# EAGLE design fonte (EAGLE 9.0.1)
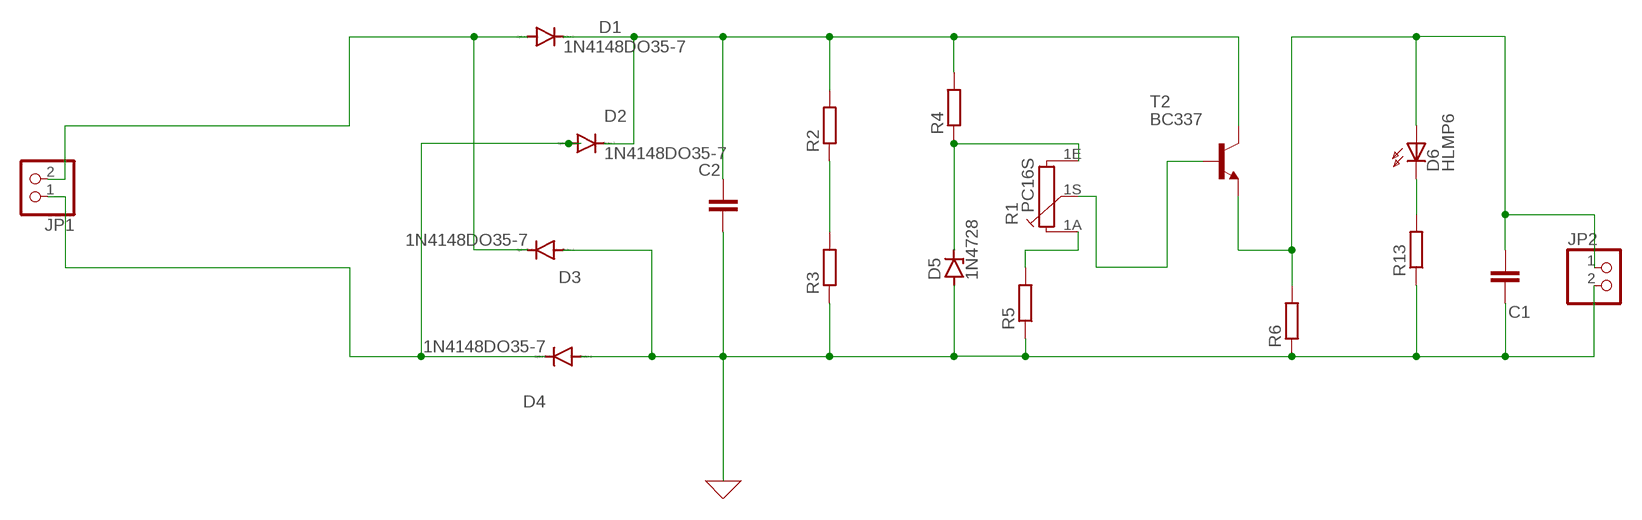
[diagram p0: schematic, sheet 1]

## Parts
C1  C5/3  [C5B3]
C2  C5/3  [C5B3]
D1  1N4148DO35-7  [DO35-7]
D2  1N4148DO35-7  [DO35-7]
D3  1N4148DO35-7  [DO35-7]
D4  1N4148DO35-7  [DO35-7]
D5  1N4728  [DO41Z10]
D6  HLMP6  [HLMP6]
JP1  PINHD-1X2  [1X02]
JP2  PINHD-1X2  [1X02]
R1  PC16S  [PC16S]
R2  R-EU_0204/7  [0204/7]
R3  R-EU_0204/7  [0204/7]
R4  R-EU_0204/7  [0204/7]
R5  R-EU_0204/7  [0204/7]
R6  R-EU_0204/7  [0204/7]
R13  R-EU_0204/7  [0204/7]
T2  BC337  [TO92]

## Nets
0: C1.1 C2.2 D3.A D4.A D5.A JP2.2 R3.1 R5.1 R6.1 R13.1 ; supply symbol labelled GND
1: C1.2 D6.A JP2.1 R6.2 T2.1(E)
N$1: R2.1 R3.2
N$2: D1.A D3.C JP1.2
N$3: R1.1A R5.2
N$4: D2.A D4.C JP1.1
N$5: D5.C R1.1E R4.1
N$6: R1.1S T2.2(B)
N$7: D6.K R13.2
N$13: C2.1 D1.C D2.C R2.2 R4.2 T2.3(C)

## Library data of the parts
C1 C2 = capacitor-wima:C: CAPACITOR naming: grid - package width
D1-D4 = diode:1N4148: DIODE high speed (Philips); SPICEMODEL: DMOD; SPICEPREFIX: D
D5 = diode:1N4728: Z DIODE 3.3 V, 1W, 5 percent; SPICEMODEL: DMOD; SPICEPREFIX: D
D6 = display-hp:HLMP6: LED 2mm horizontal; MF: AGILENT TECHNOLOGIES; MPN: HLMP-6500; OC_FARNELL: 1652490; OC_NEWARK: 40K0088
JP1 JP2 = pinhead:PINHD-1X2: PIN HEADER
R1 = piher:PC16S: POTENTIOMETER single carbon potentiometer, 16 mm, S3ROH; OC_FARNELL: 4452940; OC_NEWARK: unknown
R2-R6 R13 = rcl:R-EU_: RESISTOR, European symbol; SPICEPREFIX: R
T2 = transistor:BC337: NPN TRANSISTOR

## Board
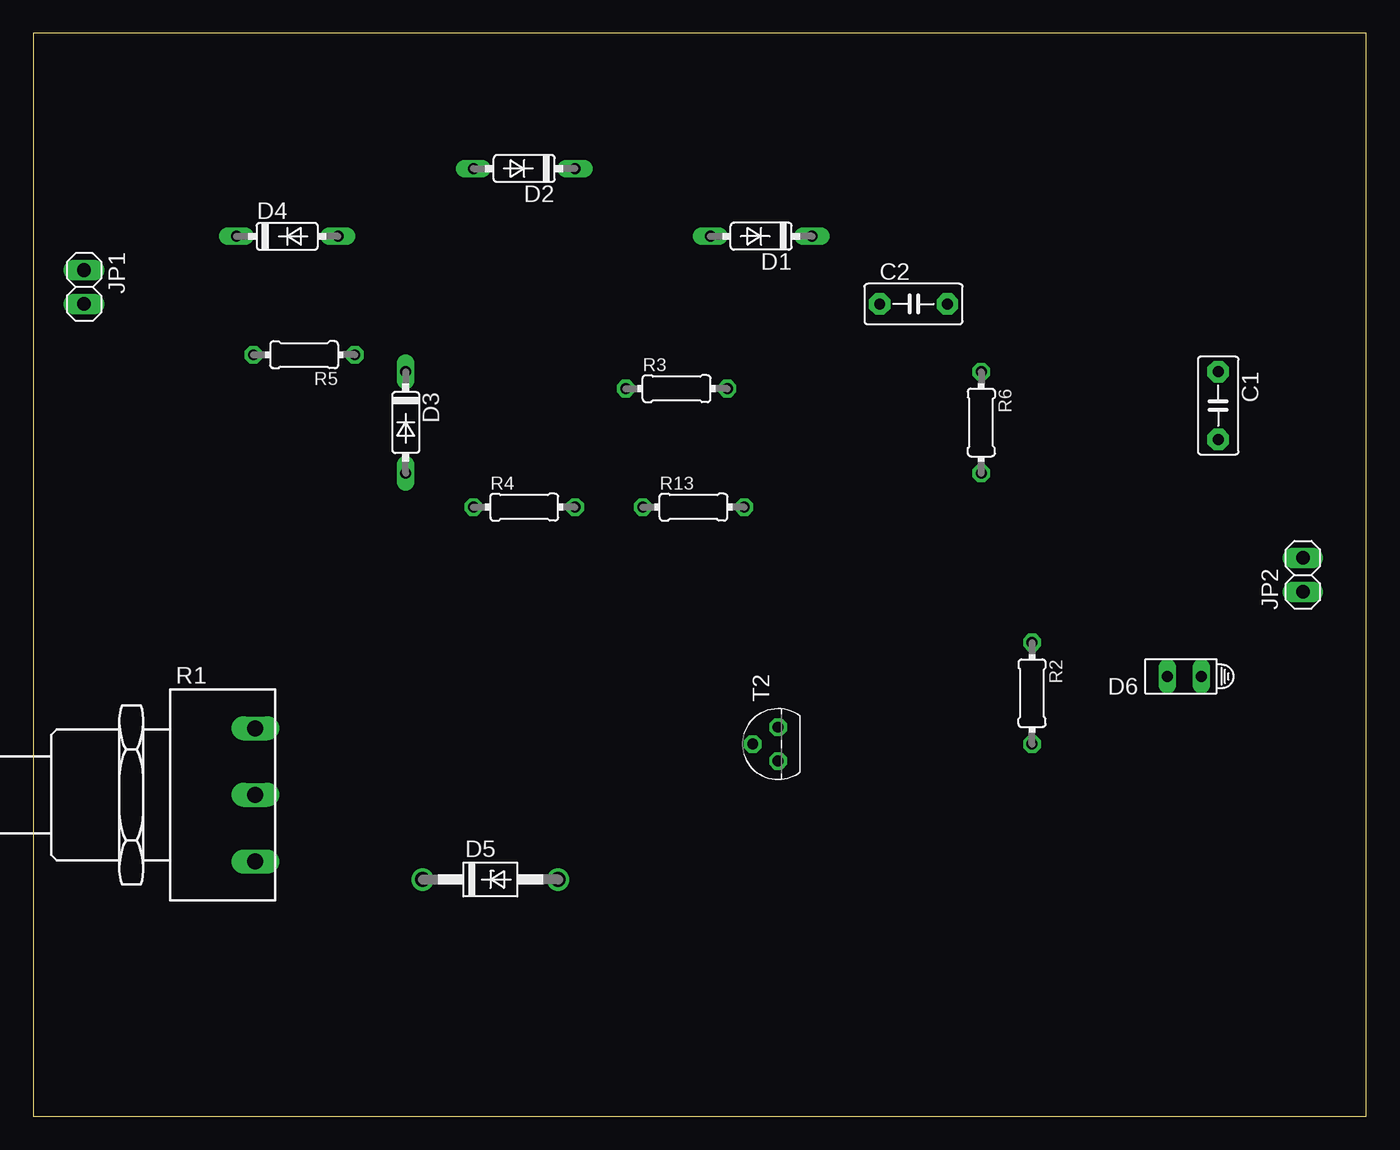
[diagram p1: board, top side]
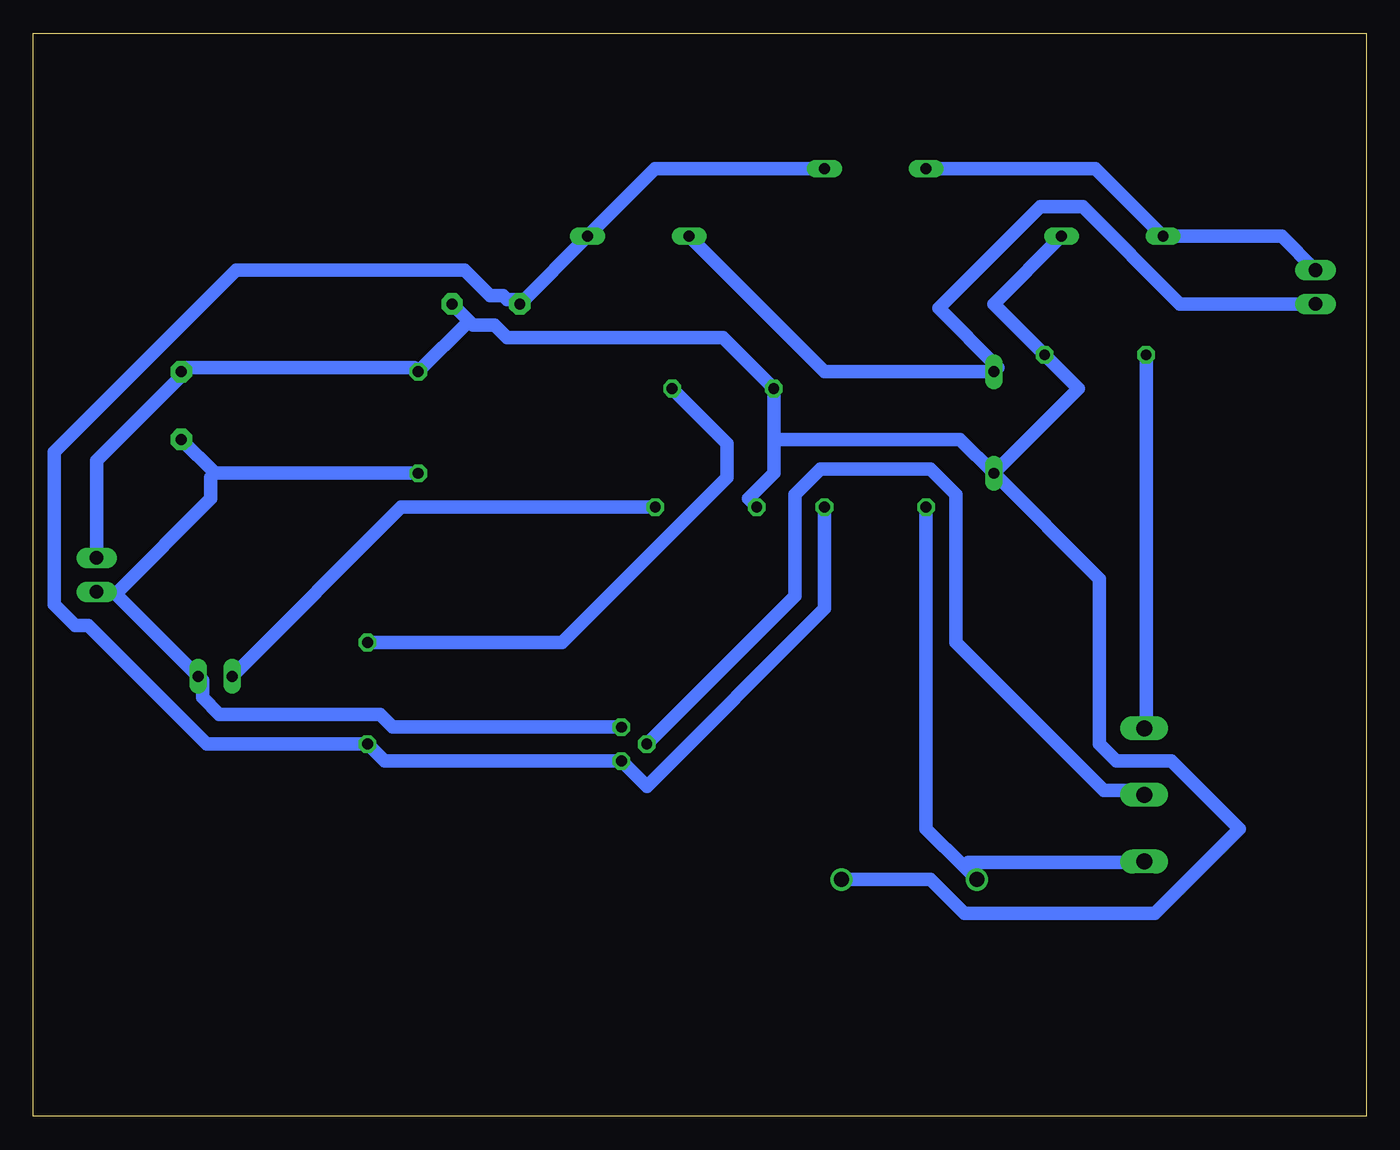
[diagram p2: board, bottom side, seen from below]

Size 100 x 81.27 mm. Coordinates in mm from the lower left corner, seen from the top.
Outline: 0,0 100,0 100,81.27 0,81.27 0,0
Copper layers (1*16): Top 0.035mm / dielectric 1.5mm / Bottom 0.035mm
Design rules "default *": minimum track width 40mil, minimum drill 0.35mm, track to track 40mil, track to pad 40mil, pad to pad 40mil, via to via 40mil, smd to smd 40mil, copper to edge 40mil, drill to drill 40mil, minimum pad ring 10mil, minimum via ring 8mil, stop-mask expansion 4mil, vias tented up to drill 0mil, thermal gap 10mil

### Footprints (pad centres in the part's own frame; a part is rotated, then mirrored left to right if it is on the bottom)
C5B3 = drill 0.813 pad 1.6 octagon: 1 -2.54,0; 2 2.54,0
DO35-7 = drill 0.813 long: A 3.81,0; C -3.81,0
DO41Z10 = drill 1.118: A 5.08,0; C -5.08,0
HLMP6 = drill 0.813 long: A -1.27,0; K 1.27,0
1X02 = drill 1.016 long: 1 -1.27,0; 2 1.27,0
PC16S = drill 1.2 long: 1A -5,6.5; 1E 5,6.5; 1S 0,6.5
0204/7 = drill 0.813 octagon: 1 -3.81,0; 2 3.81,0
TO92 = drill 0.813 octagon: 1 1.27,0; 2 0,1.905; 3 -1.27,0

### Placement (x,y rotation side)
C1  88.9,53.34 270 top
C2  66.04,60.96 0 top
D1  54.61,66.04 180 top
D2  36.83,71.12 180 top
D3  27.94,52.07 270 top
D4  19.05,66.04 0 top
D5  34.29,17.78 0 top
D6  86.36,33.02 180 top
JP1  3.81,62.23 270 top
JP2  95.25,40.64 90 top
R1  10.16,24.13 270 top
R2  74.93,31.75 270 top
R3  48.26,54.61 0 top
R4  36.83,45.72 0 top
R5  20.32,57.15 180 top
R6  71.12,52.07 270 top
R13  49.53,45.72 0 top
T2  55.88,27.94 90 top

### Tracks (layer width: path | path; a pad name or v marks a point on that pad's centre or on a via)
0
  Bottom 1.016: 67.31,59.69 R6.1 71.44,56.2 88.58,56.2 C1.1 88.9,55.56 95.25,49.21 JP2.2 | C2.2 67.31,59.69 | 44.45,50.8 44.45,48.26 46.35,46.35 R13.1 | 44.45,50.8 R3.1 48.26,58.42 64.45,58.42 65.41,59.37 66.99,59.37 67.31,59.69 | D4.A 27.94,60.96 R5.1 21.59,54.61 D3.A | D5.A 32.7,17.78 30.16,15.24 15.88,15.24 9.53,21.59 14.61,26.67 18.73,26.67 20,27.94 20,40.32 D3.A | 44.45,50.8 30.48,50.8 D3.A
1
  Bottom 1.016: 86.36,48.26 R6.2 | C1.2 86.36,48.26 | T2.1 73.03,29.21 73.98,30.16 86.04,30.16 87.31,31.43 87.31,32.7 D6.A 93.98,39.37 | 93.98,39.37 JP2.1 | 86.36,48.26 86.68,47.94 86.68,46.35 93.66,39.37 93.98,39.37
N$1
  Bottom 1.016: R2.1 60.33,35.56 47.94,47.94 47.94,50.48 R3.2
N$2
  Bottom 1.016: D1.A 40.64,55.88 D3.C 27.62,56.2 32.07,60.64 24.45,68.26 21.27,68.26 13.97,60.96 JP1.2
N$3
  Bottom 1.016: R5.2 16.51,29.21 R1.1A
N$4
  Bottom 1.016: JP1.1 6.35,66.04 D4.C 20.32,71.12 D2.A
N$5
  Bottom 1.016: R4.1 33.02,21.59 30.16,18.73 | D5.C 30.16,18.73 | R1.1E 16.83,19.05 29.84,19.05 30.16,18.73
N$6
  Bottom 1.016: T2.2 42.86,39.05 42.86,46.67 40.96,48.58 32.7,48.58 30.8,46.67 30.8,35.56 19.68,24.45 17.14,24.45 16.83,24.13 R1.1S
N$7
  Bottom 1.016: R13.2 72.39,45.72 D6.K
N$13
  Bottom 1.016: D2.C 53.34,71.12 D1.C C2.1 63.82,61.28 64.45,61.28 64.77,61.59 65.72,61.59 67.63,63.5 84.77,63.5 98.42,49.85 98.42,38.42 96.84,36.83 95.89,36.83 87,27.94 R2.2 73.66,26.67 T2.3 53.98,24.77 40.64,38.1 R4.2